# Altium schematic sheet 08usb.SchDoc
size C
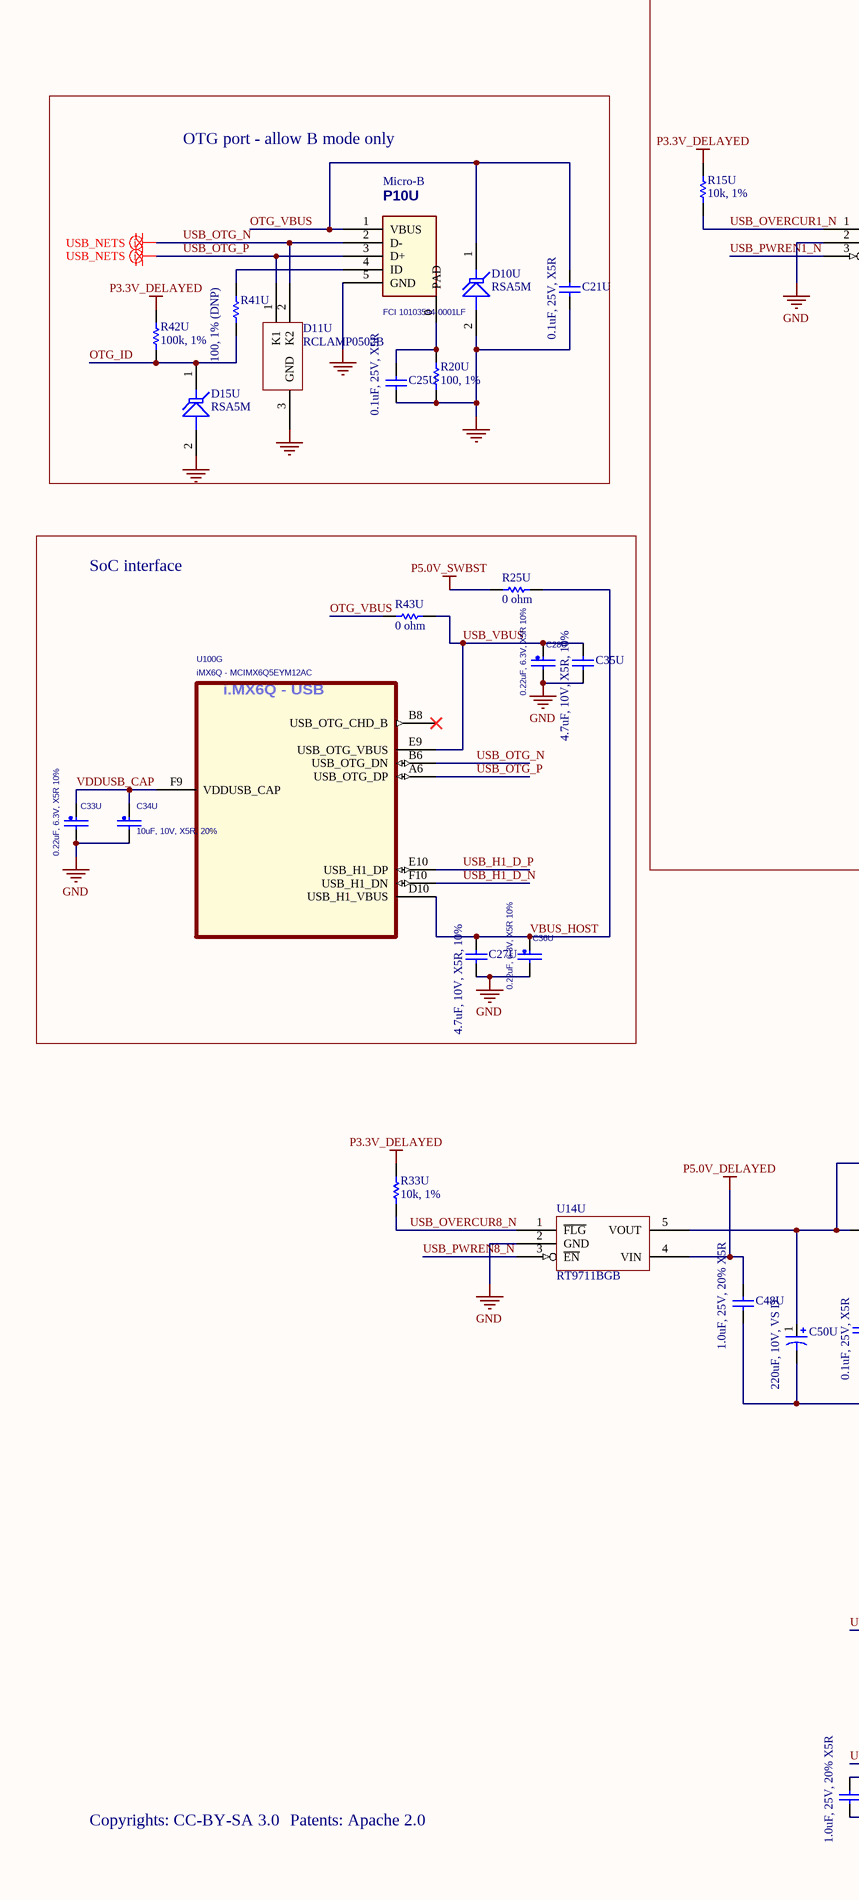
[diagram p0: 08usb.SchDoc, left]
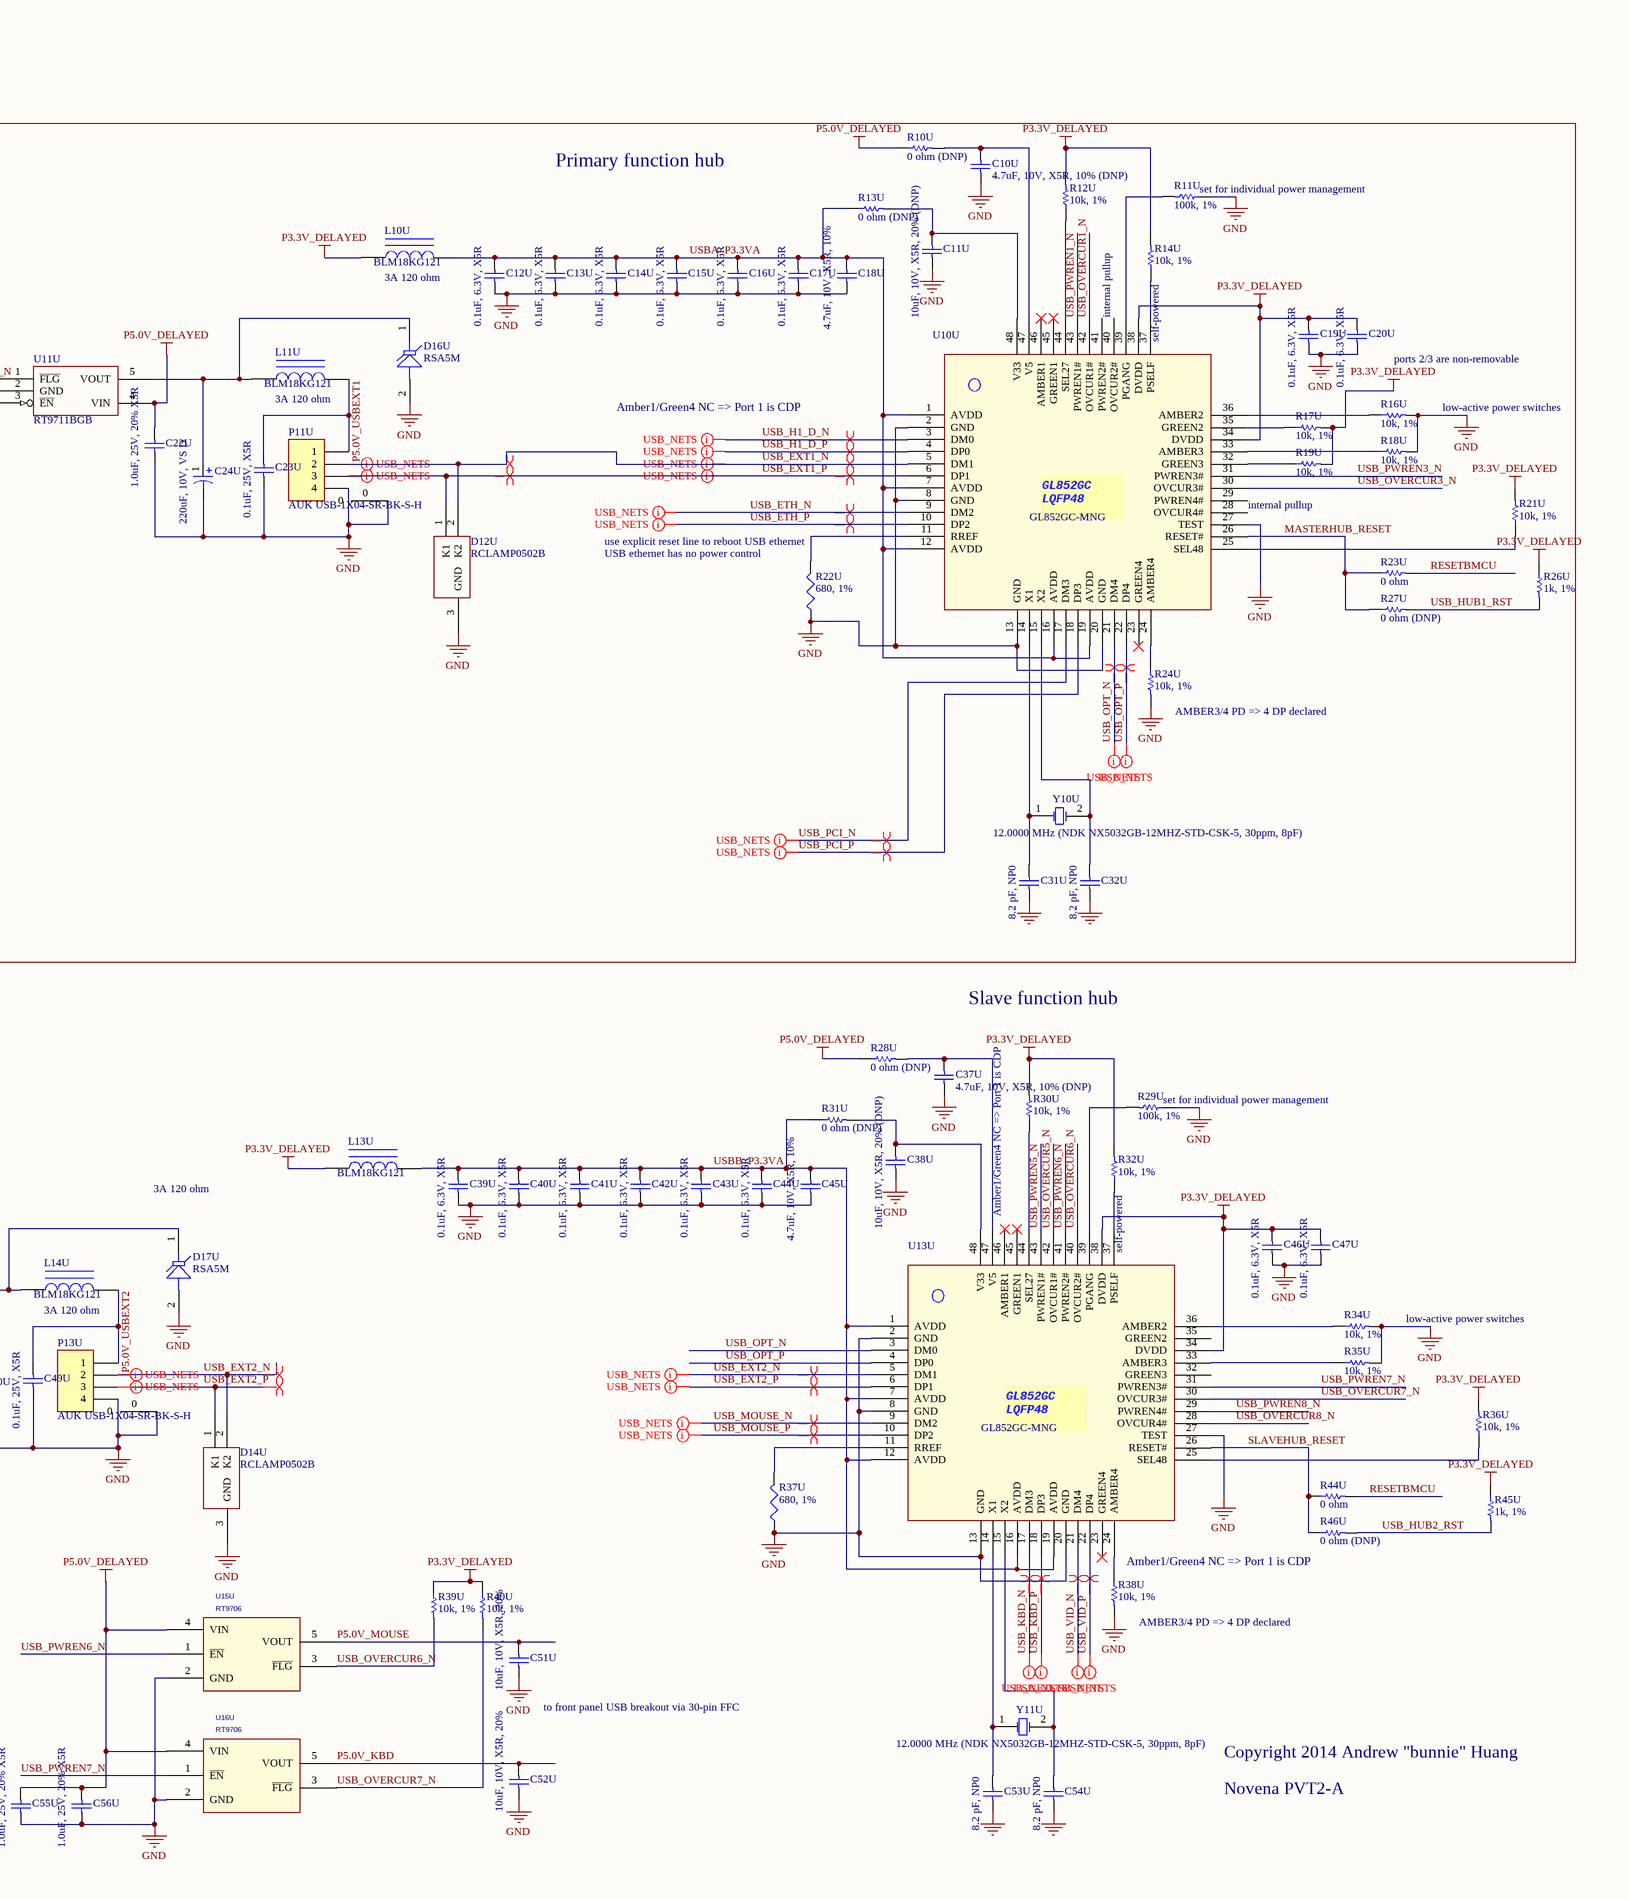
[diagram p1: 08usb.SchDoc, right]

## Parts
C10U  4.7uF, 10V, X5R, 10% (DNP)  [CAPC1608N]
C11U  10uF, 10V, X5R, 20% (DNP)  [CAPC1608N]
C12U  0.1uF, 6.3V, X5R  [CAPC0603N_B]
C13U  0.1uF, 6.3V, X5R  [CAPC0603N_B]
C14U  0.1uF, 6.3V, X5R  [CAPC0603N_B]
C15U  0.1uF, 6.3V, X5R  [CAPC0603N_B]
C16U  0.1uF, 6.3V, X5R  [CAPC0603N_B]
C17U  0.1uF, 6.3V, X5R  [CAPC0603N_B]
C18U  4.7uF, 10V, X5R, 10%  [CAPC1608N]
C19U  0.1uF, 6.3V, X5R  [CAPC0603N_B]
C20U  0.1uF, 6.3V, X5R  [CAPC0603N_B]
C21U  0.1uF, 25V, X5R  [CAPC1005N]
C22U  1.0uF, 25V, 20% X5R  [CAPC1608N]
C23U  0.1uF, 25V, X5R  [CAPC1005N]
C24U  220uF, 10V, VS D  [ALCAP_D]
C25U  0.1uF, 25V, X5R  [CAPC1005N]
C27U  4.7uF, 10V, X5R, 10%  [CAPC1608N_HD]
C28U  0.22uF, 6.3V, X5R 10%  [CAPC0603N_B]
C31U  8.2 pF, NP0  [CAPC1005N]
C32U  8.2 pF, NP0  [CAPC1005N]
C33U  0.22uF, 6.3V, X5R 10%  [CAPC0603N_B]
C34U  10uF, 10V, X5R, 20%  [CAPC1608N_HD]
C35U  4.7uF, 10V, X5R, 10%  [CAPC1608N_HD]
C36U  0.22uF, 6.3V, X5R 10%  [CAPC0603N_B]
C37U  4.7uF, 10V, X5R, 10% (DNP)  [CAPC1608N]
C38U  10uF, 10V, X5R, 20% (DNP)  [CAPC1608N]
C39U  0.1uF, 6.3V, X5R  [CAPC0603N_B]
C40U  0.1uF, 6.3V, X5R  [CAPC0603N_B]
C41U  0.1uF, 6.3V, X5R  [CAPC0603N_B]
C42U  0.1uF, 6.3V, X5R  [CAPC0603N_B]
C43U  0.1uF, 6.3V, X5R  [CAPC0603N_B]
C44U  0.1uF, 6.3V, X5R  [CAPC0603N_B]
C45U  4.7uF, 10V, X5R, 10%  [CAPC1608N]
C46U  0.1uF, 6.3V, X5R  [CAPC0603N_B]
C47U  0.1uF, 6.3V, X5R  [CAPC0603N_B]
C48U  1.0uF, 25V, 20% X5R  [CAPC1608N]
C49U  0.1uF, 25V, X5R  [CAPC1005N]
C50U  220uF, 10V, VS D  [ALCAP_D]
C51U  10uF, 10V, X5R, 20%  [CAPC1608N]
C52U  10uF, 10V, X5R, 20%  [CAPC1608N]
C53U  8.2 pF, NP0  [CAPC1005N]
C54U  8.2 pF, NP0  [CAPC1005N]
C55U  1.0uF, 25V, 20% X5R  [CAPC1608N]
C56U  1.0uF, 25V, 20% X5R  [CAPC1608N]
D10U  RSA5M  [SOD123/X.85]
D11U  RCLAMP0502B  [SOT-523]
D12U  RCLAMP0502B  [SOT-523]
D14U  RCLAMP0502B  [SOT-523]
D15U  RSA5M  [SOD123/X.85]
D16U  RSA5M  [SOD123/X.85]
D17U  RSA5M  [SOD123/X.85]
L10U  BLM18KG121  value 3A 120 ohm  [INDC1608AN]
L11U  BLM18KG121  value 3A 120 ohm  [INDC1608AN]
L13U  BLM18KG121  value 3A 120 ohm  [INDC1608AN]
L14U  BLM18KG121  value 3A 120 ohm  [INDC1608AN]
P10U  FCI 10103594-0001LF  [USB_MICRO_B_SMT]
P11U  AUK USB-1X04-SR-BK-S-H  [USB_TYPEA_TH_SINGLE]
P13U  AUK USB-1X04-SR-BK-S-H  [USB_TYPEA_TH_SINGLE]
R10U  0 ohm (DNP)  [RESC1005N]
R11U  100k, 1%  [RESC1005N]
R12U  10k, 1%  [RESC1005N]
R13U  0 ohm (DNP)  [RESC1005N]
R14U  10k, 1%  [RESC1005N]
R15U  10k, 1%  [RESC1005N]
R16U  10k, 1%  [RESC1005N]
R17U  10k, 1%  [RESC1005N]
R18U  10k, 1%  [RESC1005N]
R19U  10k, 1%  [RESC1005N]
R20U  100, 1%  [RESC1005N]
R21U  10k, 1%  [RESC1005N]
R22U  680, 1%  [RESC1005N]
R23U  0 ohm  [RESC1005N]
R24U  10k, 1%  [RESC1005N]
R25U  0 ohm  [RESC1005N]
R26U  1k, 1%  [RESC1005N]
R27U  0 ohm (DNP)  [RESC1005N]
R28U  0 ohm (DNP)  [RESC1005N]
R29U  100k, 1%  [RESC1005N]
R30U  10k, 1%  [RESC1005N]
R31U  0 ohm (DNP)  [RESC1005N]
R32U  10k, 1%  [RESC1005N]
R33U  10k, 1%  [RESC1005N]
R34U  10k, 1%  [RESC1005N]
R35U  10k, 1%  [RESC1005N]
R36U  10k, 1%  [RESC1005N]
R37U  680, 1%  [RESC1005N]
R38U  10k, 1%  [RESC1005N]
R39U  10k, 1%  [RESC1005N]
R40U  10k, 1%  [RESC1005N]
R41U  100, 1% (DNP)  [RESC1005N]
R42U  100k, 1%  [RESC1005N]
R43U  0 ohm  [RESC1005N]
R44U  0 ohm  [RESC1005N]
R45U  1k, 1%  [RESC1005N]
R46U  0 ohm (DNP)  [RESC1005N]
U10U  GL852GC-MNG  [SQFP50P900X900-48N]
U11U  RT9711BGB  [SOT23-5AN]
U13U  GL852GC-MNG  [SQFP50P900X900-48N]
U14U  RT9711BGB  [SOT23-5AN]
U15U  RT9706  [SOT23-5AN]
U16U  RT9706  [SOT23-5AN]
U100  iMX6Q - MCIMX6Q5EYM12AC  [FREESCALE_BGA624C80P25X25_2100X2100X216]  (part G of 12)
Y10U  12.0000 MHz (NDK NX5032GB-12MHZ-STD-CSK-5, 30ppm, 8pF)  [NDK_NX5032A]
Y11U  12.0000 MHz (NDK NX5032GB-12MHZ-STD-CSK-5, 30ppm, 8pF)  [NDK_NX5032A]

## Blocks framed on the sheet
Primary function hub: C10U C11U C12U C13U C14U C15U C16U C17U C18U C19U C20U C22U C23U C24U C31U C32U D12U D16U L10U L11U P11U R10U R11U R12U R13U R14U R15U R16U R17U R18U R19U R21U R22U R23U R24U R26U R27U U10U U11U Y10U
OTG port - allow B mode only: C21U C25U D10U D11U D15U P10U R20U R41U R42U
SoC interface: C27U C28U C33U C34U C35U C36U R25U R43U U100

## Nets
GND: C10U.2 C11U.2 C12U.2 C13U.2 C14U.2 C15U.2 C16U.2 C17U.2 C18U.2 C19U.2 C20U.2 C21U.2 C22U.2 C23U.2 C24U.2 C25U.2 C27U.2 C28U.2 C31U.2 C32U.2 C33U.2 C34U.2 C35U.2 C36U.2 C37U.2 C38U.2 C39U.2 C40U.2 C41U.2 C42U.2 C43U.2 C44U.2 C45U.2 C46U.2 C47U.2 C48U.2 C49U.2 C50U.2 C51U.2 C52U.2 C53U.2 C54U.2 C55U.2 C56U.2 D10U.2(A) D11U.3(GND) D12U.3(GND) D14U.3(GND) D15U.2(A) D16U.2(A) D17U.2(A) P10U.5(GND) P11U.0 P11U.4 P13U.0 P13U.4 R11U.1 R16U.2 R18U.2 R20U.2 R22U.1 R24U.2 R29U.1 R34U.2 R35U.2 R37U.1 R38U.2 U10U.2(GND) U10U.8(GND) U10U.13(GND) U10U.20(GND) U10U.27(TEST) U11U.2(GND) U13U.2(GND) U13U.8(GND) U13U.13(GND) U13U.20(GND) U13U.27(TEST) U14U.2(GND) U15U.2(GND) U16U.2(GND)
P3.3V_DELAYED: C19U.1 C20U.1 C46U.1 C47U.1 L10U.1 L13U.1 R12U.2 R14U.2 R15U.2 R17U.2 R19U.2 R21U.2 R26U.1 R30U.2 R32U.2 R33U.2 R36U.2 R39U.1 R40U.1 R42U.2 R45U.1 U10U.34(DVDD) U10U.38(DVDD) U13U.34(DVDD) U13U.38(DVDD)
P5.0V_DELAYED: C22U.1 C48U.1 C55U.1 C56U.1 R10U.1 R28U.1 U11U.4(VIN) U14U.4(VIN) U15U.4(VIN) U16U.4(VIN)
P5.0V_SWBST: R25U.2
MASTERHUB_RESET: R23U.1 R27U.1 U10U.26(RESET#)
OTG_ID: D15U.1(K) R41U.1 R42U.1
OTG_VBUS: C21U.1 D10U.1(K) P10U.1(VBUS) R43U.2
P5.0V_KBD: C52U.1 U16U.5(VOUT)
P5.0V_MOUSE: C51U.1 U15U.5(VOUT)
P5.0V_USBEXT1: C23U.1 L11U.2 P11U.1
P5.0V_USBEXT2: C49U.1 L14U.2 P13U.1
RESETBMCU: R23U.2 R44U.2
SLAVEHUB_RESET: R44U.1 R46U.1 U13U.26(RESET#)
USB_ETH_N: U10U.9(DM2)
USB_ETH_P: U10U.10(DP2)
USB_EXT1_N: D12U.2(K2) P11U.2 U10U.5(DM1)
USB_EXT1_P: D12U.1(K1) P11U.3 U10U.6(DP1)
USB_EXT2_N: D14U.2(K2) P13U.2 U13U.5(DM1)
USB_EXT2_P: D14U.1(K1) P13U.3 U13U.6(DP1)
USB_H1_D_N: U10U.3(DM0) U100.F10(USB_H1_DN)
USB_H1_D_P: U10U.4(DP0) U100.E10(USB_H1_DP)
USB_HUB1_RST: R26U.2 R27U.2
USB_HUB2_RST: R45U.2 R46U.2
USB_KBD_N: U13U.17(DM3)
USB_KBD_P: U13U.18(DP3)
USB_MOUSE_N: U13U.9(DM2)
USB_MOUSE_P: U13U.10(DP2)
USB_OPT_N: U10U.21(DM4) U13U.3(DM0)
USB_OPT_P: U10U.22(DP4) U13U.4(DP0)
USB_OTG_N: D11U.2(K2) P10U.2(D-) U100.B6(USB_OTG_DN)
USB_OTG_P: D11U.1(K1) P10U.3(D+) U100.A6(USB_OTG_DP)
USB_OVERCUR1_N: R15U.1 U10U.42(OVCUR1#) U11U.1(~{FLG})
USB_OVERCUR3_N: U10U.30(OVCUR3#)
USB_OVERCUR5_N: U13U.42(OVCUR1#)
USB_OVERCUR6_N: R39U.2 U13U.40(OVCUR2#) U15U.3(~{FLG})
USB_OVERCUR7_N: R40U.2 U13U.30(OVCUR3#) U16U.3(~{FLG})
USB_OVERCUR8_N: R33U.1 U13U.28(OVCUR4#) U14U.1(~{FLG})
USB_PCI_N: U10U.17(DM3)
USB_PCI_P: U10U.18(DP3)
USB_PWREN1_N: U10U.43(PWREN1#) U11U.3(~{EN})
USB_PWREN3_N: U10U.31(PWREN3#)
USB_PWREN5_N: U13U.43(PWREN1#)
USB_PWREN6_N: U13U.41(PWREN2#) U15U.1(~{EN})
USB_PWREN7_N: U13U.31(PWREN3#) U16U.1(~{EN})
USB_PWREN8_N: U13U.29(PWREN4#) U14U.3(~{EN})
USB_VBUS: C28U.1 C35U.1 R43U.1 U100.E9(USB_OTG_VBUS)
USB_VID_N: U13U.21(DM4)
USB_VID_P: U13U.22(DP4)
USBA_P3.3VA: C12U.1 C13U.1 C14U.1 C15U.1 C16U.1 C17U.1 C18U.1 L10U.2 R13U.1 U10U.1(AVDD) U10U.7(AVDD) U10U.12(AVDD) U10U.16(AVDD) U10U.19(AVDD)
USBB_P3.3VA: C39U.1 C40U.1 C41U.1 C42U.1 C43U.1 C44U.1 C45U.1 L13U.2 R31U.1 U13U.1(AVDD) U13U.7(AVDD) U13U.12(AVDD) U13U.16(AVDD) U13U.19(AVDD)
VBUS_HOST: C27U.1 C36U.1 R25U.1 U100.D10(USB_H1_VBUS)
VDDUSB_CAP: C33U.1 C34U.1 U100.F9(VDDUSB_CAP)
NetC10U_1: C10U.1 R10U.2 U10U.47(V5)
NetC11U_1: C11U.1 R13U.2 U10U.48(V33)
NetC24U_1: C24U.1 D16U.1(K) L11U.1 U11U.5(VOUT)
NetC25U_1: C25U.1 P10U.0(PAD) R20U.1
NetC31U_1: C31U.1 U10U.14(X1) Y10U.1(OSC1)
NetC32U_1: C32U.1 U10U.15(X2) Y10U.2(OSC2)
NetC37U_1: C37U.1 R28U.2 U13U.47(V5)
NetC38U_1: C38U.1 R31U.2 U13U.48(V33)
NetC50U_1: C50U.1 D17U.1(K) L14U.1 U14U.5(VOUT)
NetC53U_1: C53U.1 U13U.14(X1) Y11U.1(OSC1)
NetC54U_1: C54U.1 U13U.15(X2) Y11U.2(OSC2)
NetP10U_4: P10U.4(ID) R41U.2
NetR11U_2: R11U.2 U10U.39(PGANG)
NetR12U_1: R12U.1 U10U.44(SEL27)
NetR14U_1: R14U.1 U10U.37(PSELF)
NetR16U_1: R16U.1 U10U.36(AMBER2)
NetR17U_1: R17U.1 U10U.35(GREEN2)
NetR18U_1: R18U.1 U10U.33(AMBER3)
NetR19U_1: R19U.1 U10U.32(GREEN3)
NetR21U_1: R21U.1 U10U.25(SEL48)
NetR22U_2: R22U.2 U10U.11(RREF)
NetR24U_1: R24U.1 U10U.24(AMBER4)
NetR29U_2: R29U.2 U13U.39(PGANG)
NetR30U_1: R30U.1 U13U.44(SEL27)
NetR32U_1: R32U.1 U13U.37(PSELF)
NetR34U_1: R34U.1 U13U.36(AMBER2)
NetR35U_1: R35U.1 U13U.33(AMBER3)
NetR36U_1: R36U.1 U13U.25(SEL48)
NetR37U_2: R37U.2 U13U.11(RREF)
NetR38U_1: R38U.1 U13U.24(AMBER4)

Not connected (* = marked no-connect by the designer): U10U 23(GREEN4)* 28(OVCUR4#) 29(PWREN4#) 40(OVCUR2#) 41(PWREN2#) 45(GREEN1)* 46(AMBER1)*; U13U 23(GREEN4)* 32(GREEN3) 35(GREEN2) 45(GREEN1)* 46(AMBER1)*; U100 B8(USB_OTG_CHD_B)*

## Layout directives
net class USB_NETS: USB_ETH_N, USB_ETH_P, USB_EXT1_N, USB_EXT1_P, USB_EXT2_N, USB_EXT2_P, USB_H1_D_N, USB_H1_D_P, USB_KBD_N, USB_KBD_P, USB_MOUSE_N, USB_MOUSE_P, USB_OPT_N, USB_OPT_P, USB_OTG_N, USB_OTG_P, USB_PCI_N, USB_PCI_P, USB_VID_N, USB_VID_P
differential pair: USB_ETH_N, USB_ETH_P, USB_EXT1_N, USB_EXT1_P, USB_EXT2_N, USB_EXT2_P, USB_H1_D_N, USB_H1_D_P, USB_KBD_N, USB_KBD_P, USB_MOUSE_N, USB_MOUSE_P, USB_OPT_N, USB_OPT_P, USB_OTG_N, USB_OTG_P, USB_PCI_N, USB_PCI_P, USB_VID_N, USB_VID_P

## Notes on the sheet
- (near R11U) set for individual power management
- (near P10U) Micro-B
- internal pullup
- self-powered
- ports 2/3 are non-removable
- Amber1/Green4 NC => Port 1 is CDP
- low-active power switches
- (near R22U) USB ethernet has no power control
- (near R22U) use explicit reset line to reboot USB ethernet
- (near R24U) AMBER3/4 PD => 4 DP declared
- Slave function hub
- (near R29U) set for individual power management
- (near R30U) Amber1/Green4 NC => Port 1 is CDP
- (near R38U) AMBER3/4 PD => 4 DP declared
- to front panel USB breakout via 30-pin FFC
- Copyright 2014 Andrew "bunnie" Huang
- Novena PVT2-A
- Copyrights: CC-BY-SA 3.0
- Patents: Apache 2.0
- (in symbol GLI8024-48_4) GL852GC / LQFP48
- (in symbol PCIMX6Q6VV1A, part G) i.MX6Q - USB

## Library data of the parts
C10U C11U C12U C13U C14U C15U C16U C17U C18U C19U C20U C21U C22U C23U C25U C27U C31U C32U C35U C37U C38U C39U C40U C41U C42U C43U C44U C45U C46U C47U C48U C49U C51U C52U C53U C54U C55U C56U = Cap Semi: Capacitor (Semiconductor SIM Model); Published: 8-Jun-2000; LatestRevisionDate: 17-Jul-2002; LatestRevisionNote: Re-released for DXP Platform.; PackageReference: C1206; Publisher: Altium Limited
C24U C50U = Cap Pol3: Polarized Capacitor (Surface Mount); Published: 8-Jun-2000; LatestRevisionDate: 17-Jul-2002; LatestRevisionNote: Re-released for DXP Platform.; PackageReference: C0805; Publisher: Altium Limited
C28U C36U = CAP_NP_Dup1: CAP CER 0.22UF 6.3V 20% X5R 0201; CLASS: DISCRETE; AGILE_PN: 150-75465; MFG_NAME01: MURATA; MFG_PN01: GRM033R70J103KA01D; CAD_APPROVED: YES; FPLIST: CC0201,CC0201_HD,0201_CC,cc_0201_cir; PRIORITY_PN: 021-00273; ROOM: CPU; Tolerance: 10%; ROHS: Yes; HEIGHT: 0.33 MM
C33U = CAP_NP_Dup1: CAP CER 0.22UF 6.3V 20% X5R 0201; CLASS: DISCRETE; ROOM: CPU; PRIORITY_PN: 021-00278; FPLIST: CC0201,CC0201_HD,0201_CC; CAD_APPROVED: Yes; MFG_PN01: JMK063BJ224MP-F; MFG_NAME01: TAIYO YUDEN; AGILE_PN: 150-77852; HEIGHT: 0.33 MM; ROHS: Yes; Tolerance: 20%
C34U = CAP_NP_Dup1: CAP CER 10UF 6.3V 10% X5R 0603; CLASS: DISCRETE; AGILE_PN: 150-77832; MFG_NAME01: CAL-CHIP; MFG_PN01: GMC10X5R106K6R3NT-LF; CAD_APPROVED: Yes; FPLIST: CC0603_OV,CC0603,0603_CC; PRIORITY_PN: 021-00276; Tolerance: 10%; ROHS: Yes; HEIGHT: 1.0MM
D10U D15U D16U D17U = Tranzorb: Published: 24-Mar-1999; LatestRevisionDate: 17-Jul-2002; LatestRevisionNote: Re-released for DXP Platform.; PackageReference: DO-7; Publisher: Altium Limited
D11U D12U D14U = RCLAMP0502B: 2-channel ESD/CDE protection device for 5V devices
L10U L11U L13U L14U = Inductor Iron: Magnetic-Core Inductor; Published: 24-Mar-1999; LatestRevisionDate: 17-Jul-2002; LatestRevisionNote: Re-released for DXP Platform.; PackageReference: AXIAL-0.9; Publisher: Altium Limited
P10U = USB_MINI-AB_1: Micro USB B type connector, i.e. FCI 10103594
P11U P13U = Header 4: Header, 4-Pin; LatestRevisionDate: 17-Jul-2002; LatestRevisionNote: Re-released for DXP Platform.; Publisher: Altium Limited
R10U R12U R13U R14U R15U R16U R17U R18U R19U R20U R21U R23U R24U R25U R26U R27U R28U R30U R31U R32U R33U R34U R35U R36U R38U R39U R40U R41U R43U R44U R45U R46U = Res1: Resistor; Value: 100k; Published: 8-Jun-2000; LatestRevisionDate: 17-Jul-2002; LatestRevisionNote: Re-released for DXP Platform.; PackageReference: AXIAL-0.3; Publisher: Altium Limited
R11U R29U R42U = Res1: Resistor; Published: 8-Jun-2000; LatestRevisionDate: 17-Jul-2002; LatestRevisionNote: Re-released for DXP Platform.; PackageReference: AXIAL-0.3; Publisher: Altium Limited; Value: 100k
R22U R37U = Res3: Resistor; Published: 8-Jun-2000; LatestRevisionDate: 04-Mar-2005; LatestRevisionNote: PCB Footprint replaced.; PackageReference: J1-0603; Publisher: Altium Limited
U10U U13U = GLI8024-48_4: 4-port multiple-TT hub with USB charging support
U11U U14U = RT9711BGB: 1.5A high-side power switch, active low enable
U15U U16U = RT9706: IC LIN SW W/FLAG 500MA 2.0-5.5V SOT23-5; AGILE_PN: 315-77830; MFG_NAME01: RICHTEK; MFG_PN01: RT9706PB; CAD_APPROVED: Yes; ROHS: Yes; HEIGHT: 1.295MM
U100 = PCIMX6Q6VV1A: PCIMX6Q5EVT10AC; AGILE_PN: TMP-WF-14526; MFG_NAME01: Freescale Semiconductor; PRE_APN: 344-01218; MFG_PN01: PCIMX6Q6VV1A; ROHS: Yes; HEIGHT: 2.16MM
Y10U Y11U = XTAL: Crystal Oscillator; Published: 8-Jun-2000; LatestRevisionDate: 17-Jul-2002; LatestRevisionNote: Re-released for DXP Platform.; PackageReference: R38; Publisher: Altium Limited